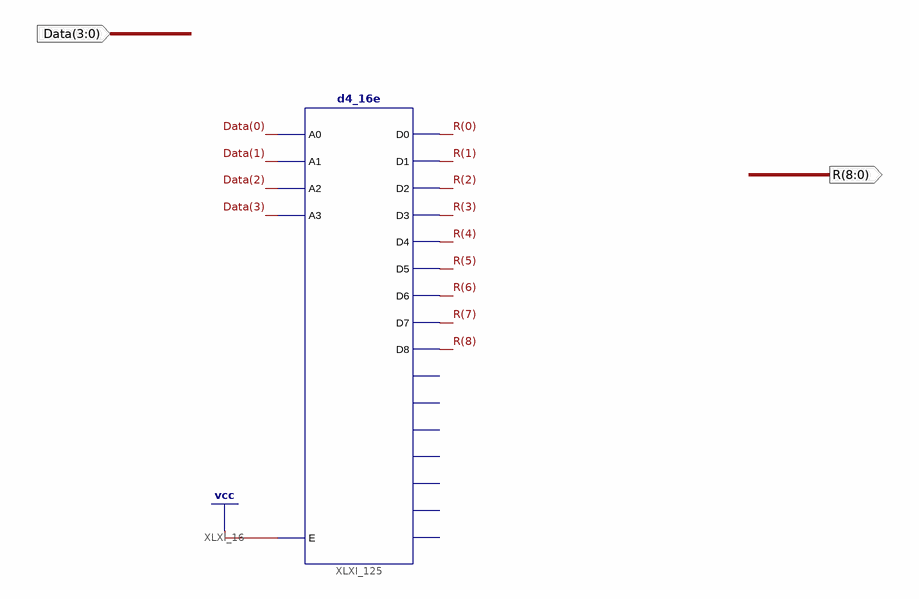
[diagram p0: schematic sheet 1]
// Xilinx ISE schematic LEDshow.sch (spartan6) as structural Verilog: 1 symbols, 2 ports
module LEDshow (
  input  [3:0] Data,
  output [8:0] R
);

  d4_16e XLXI_125 (
    .A0(Data[0]), .A1(Data[1]), .A2(Data[2]), .A3(Data[3]), .E(1'b1), .D0(R[0]), .D1(R[1]), .D2(R[2]),
    .D3(R[3]), .D4(R[4]), .D5(R[5]), .D6(R[6]), .D7(R[7]), .D8(R[8]));  // open: D10, D11, D12, D13, D14, D15, D9
endmodule
